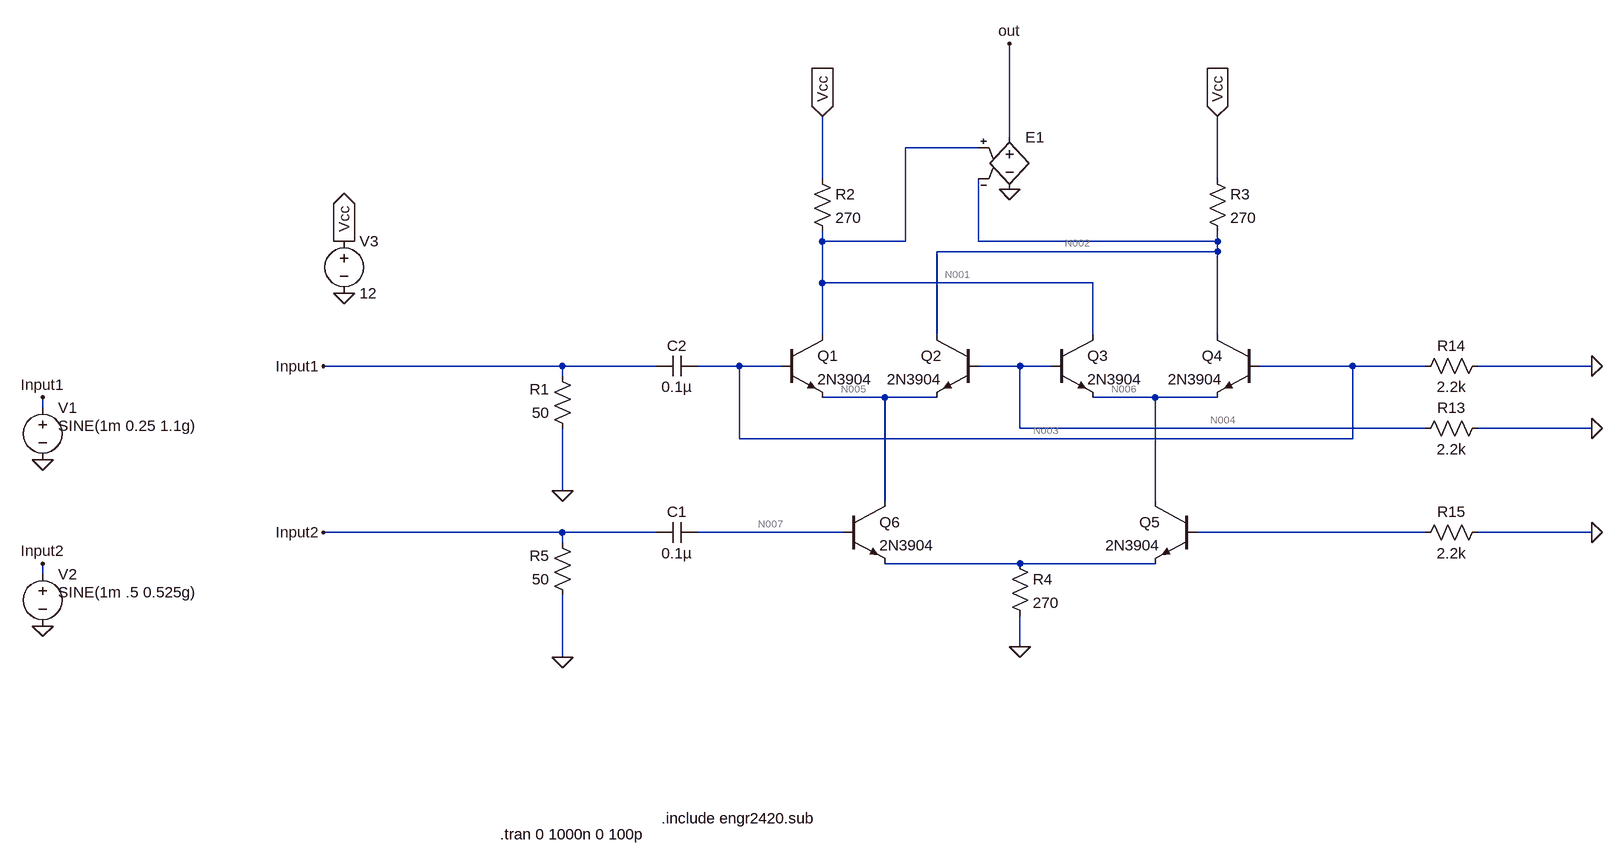
[diagram p0: schematic GilbertCell_w_o_stabilizer.asc]
GilbertCell_w_o_stabilizer.asc, the LTspice schematic file:
Version 4
SHEET 1 2744 680
WIRE 656 -768 656 -912
WIRE 608 -752 496 -752
WIRE 368 -704 368 -800
WIRE 976 -704 976 -800
WIRE 368 -608 368 -624
WIRE 496 -608 496 -752
WIRE 496 -608 368 -608
WIRE 608 -608 608 -704
WIRE 976 -608 976 -624
WIRE 976 -608 608 -608
WIRE 976 -592 976 -608
WIRE 976 -592 544 -592
WIRE 368 -544 368 -608
WIRE 784 -544 368 -544
WIRE 368 -464 368 -544
WIRE 544 -464 544 -592
WIRE 784 -464 784 -544
WIRE 976 -464 976 -592
WIRE -32 -416 -400 -416
WIRE 112 -416 -32 -416
WIRE 240 -416 176 -416
WIRE 304 -416 240 -416
WIRE 672 -416 608 -416
WIRE 720 -416 672 -416
WIRE 1184 -416 1040 -416
WIRE 1296 -416 1184 -416
WIRE 1552 -416 1376 -416
WIRE -32 -400 -32 -416
WIRE 464 -368 368 -368
WIRE 544 -368 464 -368
WIRE 880 -368 784 -368
WIRE 976 -368 880 -368
WIRE -832 -352 -832 -368
WIRE 672 -320 672 -416
WIRE 1296 -320 672 -320
WIRE 1552 -320 1376 -320
WIRE 240 -304 240 -416
WIRE 1184 -304 1184 -416
WIRE 1184 -304 240 -304
WIRE -32 -224 -32 -320
WIRE 464 -208 464 -368
WIRE 880 -208 880 -368
WIRE -32 -160 -400 -160
WIRE 112 -160 -32 -160
WIRE 400 -160 176 -160
WIRE 1296 -160 944 -160
WIRE 1552 -160 1376 -160
WIRE -32 -144 -32 -160
WIRE 672 -112 464 -112
WIRE 880 -112 672 -112
WIRE -832 -96 -832 -112
WIRE 672 16 672 -32
WIRE -32 32 -32 -64
FLAG 672 16 0
FLAG -832 -272 0
FLAG -368 -528 0
FLAG 368 -800 Vcc
IOPIN 368 -800 In
FLAG -368 -608 Vcc
IOPIN -368 -608 Out
FLAG -32 -224 0
FLAG 976 -800 Vcc
IOPIN 976 -800 In
FLAG 656 -688 0
FLAG 656 -912 out
FLAG -832 -16 0
FLAG -32 32 0
FLAG -832 -112 Input2
FLAG -400 -160 Input2
FLAG -832 -368 Input1
FLAG -400 -416 Input1
FLAG 1552 -416 0
FLAG 1552 -320 0
FLAG 1552 -160 0
SYMBOL npn 304 -464 R0
SYMATTR InstName Q1
SYMATTR Value 2N3904
SYMBOL npn 608 -464 M0
SYMATTR InstName Q2
SYMATTR Value 2N3904
SYMBOL npn 400 -208 R0
SYMATTR InstName Q6
SYMATTR Value 2N3904
SYMBOL res -16 -304 R180
WINDOW 0 36 76 Left 2
WINDOW 3 36 40 Left 2
SYMATTR InstName R1
SYMATTR Value 50
SYMBOL res 352 -720 R0
SYMATTR InstName R2
SYMATTR Value 270
SYMBOL res 960 -720 R0
SYMATTR InstName R3
SYMATTR Value 270
SYMBOL res 656 -128 R0
SYMATTR InstName R4
SYMATTR Value 270
SYMBOL voltage -368 -624 R0
WINDOW 123 0 0 Left 0
WINDOW 39 0 0 Left 0
SYMATTR InstName V3
SYMATTR Value 12
SYMBOL npn 720 -464 R0
SYMATTR InstName Q3
SYMATTR Value 2N3904
SYMBOL npn 1040 -464 M0
SYMATTR InstName Q4
SYMATTR Value 2N3904
SYMBOL npn 944 -208 M0
SYMATTR InstName Q5
SYMATTR Value 2N3904
SYMBOL cap 176 -432 R90
WINDOW 0 0 32 VBottom 2
WINDOW 3 32 32 VTop 2
SYMATTR InstName C2
SYMATTR Value 0.1µ
SYMBOL voltage -832 -368 R0
WINDOW 3 24 44 Left 2
WINDOW 123 24 72 Left 2
WINDOW 39 0 0 Left 0
SYMATTR Value SINE(1m 0.25 1.1g)
SYMATTR InstName V1
SYMBOL res 1392 -336 R90
WINDOW 0 0 56 VBottom 2
WINDOW 3 32 56 VTop 2
SYMATTR InstName R13
SYMATTR Value 2.2k
SYMBOL res 1392 -432 R90
WINDOW 0 0 56 VBottom 2
WINDOW 3 32 56 VTop 2
SYMATTR InstName R14
SYMATTR Value 2.2k
SYMBOL res 1392 -176 R90
WINDOW 0 0 56 VBottom 2
WINDOW 3 32 56 VTop 2
SYMATTR InstName R15
SYMATTR Value 2.2k
SYMBOL e 656 -784 R0
WINDOW 3 24 96 Invisible 2
SYMATTR Value 1
SYMATTR InstName E1
SYMBOL voltage -832 -112 R0
WINDOW 3 24 44 Left 2
WINDOW 39 0 0 Left 0
SYMATTR Value SINE(1m .5 0.525g)
SYMATTR InstName V2
SYMBOL res -16 -48 R180
WINDOW 0 36 76 Left 2
WINDOW 3 36 40 Left 2
SYMATTR InstName R5
SYMATTR Value 50
SYMBOL cap 176 -176 R90
WINDOW 0 0 32 VBottom 2
WINDOW 3 32 32 VTop 2
SYMATTR InstName C1
SYMATTR Value 0.1µ
TEXT 120 280 Left 2 !.include engr2420.sub
TEXT -128 304 Left 2 !.tran 0 1000n 0 100p

The netlist it stands for:
* GilbertCell_w_o_stabilizer.asc
Q1 N001 N003 N005 0 2N3904
Q2 N002 N004 N005 0 2N3904
Q6 N005 N007 N009 0 2N3904
R1 0 Input1 50
R2 Vcc N001 270
R3 Vcc N002 270
R4 N009 0 270
V3 Vcc 0 12
Q3 N001 N004 N006 0 2N3904
Q4 N002 N003 N006 0 2N3904
Q5 N006 N008 N009 0 2N3904
C2 N003 Input1 0.1µ
V1 Input1 0 SINE(1m 0.25 1.1g)
R13 0 N004 2.2k
R14 0 N003 2.2k
R15 0 N008 2.2k
E1 out 0 N001 N002 1
V2 Input2 0 SINE(1m .5 0.525g)
R5 0 Input2 50
C1 N007 Input2 0.1µ
.model NPN NPN
.model PNP PNP
.lib standard.bjt
.include engr2420.sub
.tran 0 1000n 0 100p
.backanno
.end

* Results of the author's LTspice run, read from the files saved beside the schematic
* Operating Point, zero values left out:
*   V(n001) = 12 V
*   V(n003) = 52.84 nV
*   V(n005) = 6.068 mV
*   V(n002) = 12 V
*   V(n004) = 52.84 nV
*   V(n007) = 3.164 mV
*   V(input1) = 1 mV
*   V(vcc) = 12 V
*   V(n006) = 5.303 mV
*   V(input2) = 1 mV
*   Ic(Q4) = 11.99 pA
*   Ib(Q4) = -12.01 pA
*   Ic(Q3) = 11.99 pA
*   Ib(Q3) = -12.01 pA
*   Ic(Q2) = 12.01 pA
*   Ib(Q2) = -12.01 pA
*   Ic(Q1) = 12.01 pA
*   Ib(Q1) = -12.01 pA
*   I(R5) = -20 µA
*   I(R14) = -24.02 pA
*   I(R13) = -24.02 pA
*   I(R3) = 24.03 pA
*   I(R2) = 24.03 pA
*   I(R1) = -20 µA
*   I(V2) = -20 µA
*   I(V1) = -20 µA
*   I(V3) = -48.05 pA